# EAGLE design attinier85-motherboard-smd-mk-2.0 (EAGLE 7.5.0)
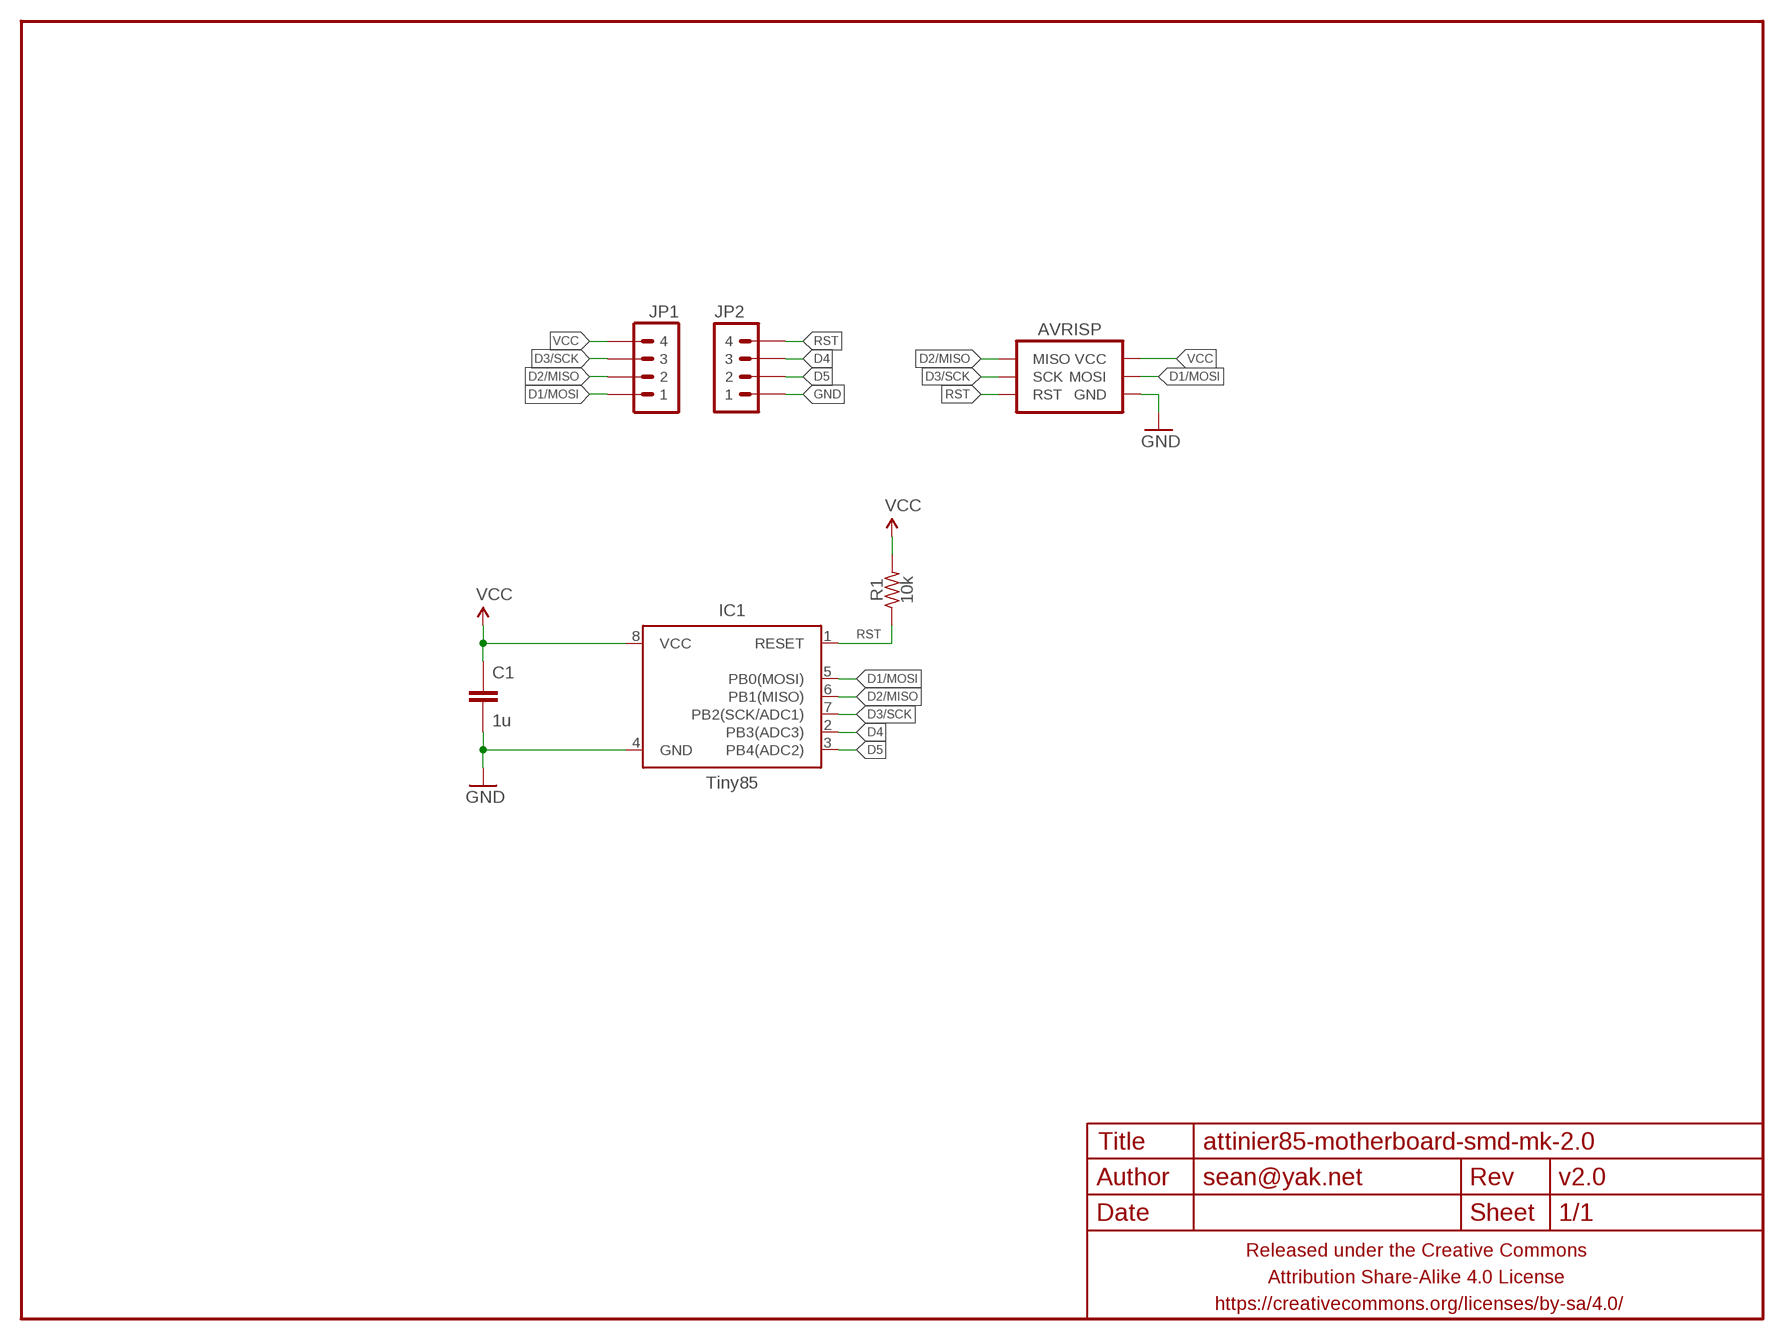
[diagram p0: schematic, sheet 1]

## Parts
AVRISP  AVR_SPI_PRG_6SMD_TEST_POINTS  [2X3_SMD_TEST_POINTS]
C1  1u  CAPACITOR-CERAMICC0603-TIGHTER  [C0603-TIGHTER]
FRAME1  FRAME-LETTERNO_PACKAGE  [DUMMY]
IC1  Tiny85  ATTINY45TINY85-20-SOICW  [SO08-EIAJ]
JP1  M04PTH  [1X04-PTH-VERT]
JP2  M04PTH  [1X04-PTH-VERT]
R1  10k  RESISTORR0603-TIGHTER  [R0603-TIGHTER]

## Nets
D1/MOSI: AVRISP.4(MOSI) IC1.5(PB0(MOSI)) JP1.1
D2/MISO: AVRISP.1(MISO) IC1.6(PB1(MISO)) JP1.2
D3/SCK: AVRISP.3(SCK) IC1.7(PB2(SCK/ADC1)) JP1.3
D4: IC1.2(PB3(ADC3)) JP2.3
D5: IC1.3(PB4(ADC2)) JP2.2
GND: AVRISP.6(GND) C1.2 IC1.4(GND) JP2.1
RST: AVRISP.5(RST) IC1.1(RESET) JP2.4 R1.1
VCC: AVRISP.2(VCC) C1.1 IC1.8(VCC) JP1.4 R1.2

## Library data of the parts
AVRISP = a_parts:AVR_SPI_PRG_6: AVR ISP 6 Pin This is the reduced ISP connector for AVR programming. Common on Arduino. This footprint will take up less PCB space and can be used with a 10-pin to 6-pin adapter such as SKU: BOB-08508 **Special note about "TEST_POINT" package. The stop mask is on the top side, so if you want your programming test points to be on the bottom of your board, make sure to place this package on the bottom side of the board. This also ensure that the orientation to program from the bottom side will be correct.
C1 = a_parts:CAPACITOR-CERAMIC: CAPACITOR, European symbol
FRAME1 = a_parts:FRAME-LETTER: Schematic Frame Standard 8.5x11 US Letter frame; DESIGNER: sean@yak.net; VERSION: v2.0
IC1 = a_parts:ATTINY45: Atmel 8-pin 2/4/8kB flash uC; PROD_ID: IC-09092; VALUE: Tiny85-20-SMT
JP1 JP2 = a_parts:M04: Header 4 Standard 4-pin 0.1" header. Use with straight break away headers (SKU : PRT-00116), right angle break away headers (PRT-00553), swiss pins (PRT-00743), machine pins (PRT-00117), and female headers (PRT-00115). Molex polarized connector foot print use with SKU : PRT-08231 with associated crimp pins and housings. 1MM SMD Version SKU: PRT-10208
R1 = a_parts:RESISTOR: RESISTOR, American symbol

## Board
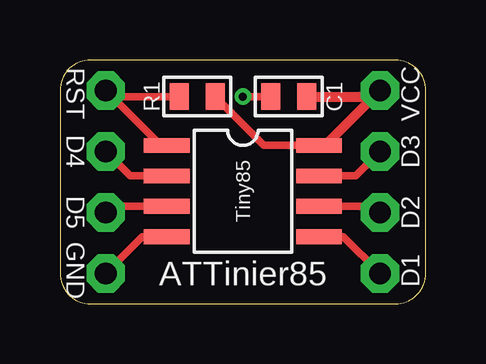
[diagram p1: board, top side]
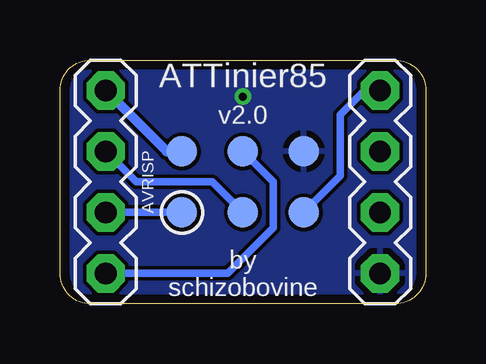
[diagram p2: board, bottom side, seen from below]

Size 15.24 x 10.16 mm. Coordinates in mm from the lower left corner, seen from the top.
Outline: 15.24,1.27 15.24,8.89 arc90 13.97,10.16 1.27,10.16 arc90 0,8.89 0,1.27 arc90 1.27,0 13.97,0 arc90 15.24,1.27
Copper layers (1*16): Top 0.0356mm / dielectric 1.5011mm / Bottom 0.0356mm
Design rules "LaenPCBOrder2": minimum track width 6mil, minimum drill 13mil, track to track 6mil, track to pad 6mil, pad to pad 6mil, via to via 6mil, smd to smd 6mil, copper to edge 15mil, drill to drill 6mil, minimum pad ring 7mil, minimum via ring 7mil, stop-mask expansion 3mil, vias tented up to drill 20mil, thermal gap 10mil

### Footprints (pad centres in the part's own frame; a part is rotated, then mirrored left to right if it is on the bottom)
2X3_SMD_TEST_POINTS = smd 1.27 x 1.27: 1 -2.54,-1.27; 2 -2.54,1.27; 3 0,-1.27; 4 0,1.27; 5 2.54,-1.27; 6 2.54,1.27
C0603-TIGHTER = smd 0.8 x 1.1: 1 -0.75,0; 2 0.75,0
SO08-EIAJ = smd 0.61 x 1.905: 1 -1.905,-3.175; 2 -0.635,-3.175; 3 0.635,-3.175; 4 1.905,-3.175; 5 1.905,3.175; 6 0.635,3.175; 7 -0.635,3.175; 8 -1.905,3.175
1X04-PTH-VERT = drill 0.9 pad 1.6 octagon: 1 0,0; 2 2.54,0; 3 5.08,0; 4 7.62,0
R0603-TIGHTER = smd 0.8 x 1.1: 1 -0.75,0; 2 0.75,0

### Placement (x,y rotation side)
AVRISP  7.62,5.08 0 bottom
C1  9.53,8.64 180 top
FRAME1  0,0 0 top
IC1  7.62,4.7 270 top
JP1  13.34,1.27 90 bottom
JP2  1.91,1.27 90 bottom
R1  5.71,8.64 0 top

### Tracks (layer width: path | path; a pad name or v marks a point on that pad's centre or on a via)
D1/MOSI
  Top 0.305: IC1.5 11.81,2.79 JP1.1
  Bottom 0.305: AVRISP.4 6.35,5.08 6.35,3.17 8.26,1.27 JP1.1
D2/MISO
  Top 0.305: IC1.6 13.08,4.06 JP1.2
  Bottom 0.305: AVRISP.1 JP1.2
D3/SCK
  Top 0.305: IC1.7 12.32,5.33 JP1.3
  Bottom 0.305: AVRISP.3 8.89,5.08 12.06,5.08 JP1.3
D4
  Top 0.305: IC1.2 2.92,5.33 JP2.3
D5
  Top 0.305: IC1.3 2.16,4.06 JP2.2
GND  (via drill 0.33)
  Top 0.305: JP2.1 3.43,2.79 IC1.4 | v7.62,8.64 C1.2
  pour Bottom: 1.27,10.16 13.97,10.16 arc-90 15.24,8.89 15.24,1.27 arc-90 13.97,0 1.27,0 arc-90 0,1.27 0,8.89 arc-90
RST
  Top 0.305: R1.1 2.16,8.64 JP2.4 4.19,6.6 IC1.1
  Bottom 0.305: AVRISP.5 3.56,5.33 3.56,7.87 2.54,8.89 JP2.4
VCC
  Top 0.305: R1.2 8.5,6.6 IC1.8
  Top 0.406: IC1.8 11.05,6.6 JP1.4 13.08,8.64 C1.1
  Bottom 0.406: AVRISP.2 10.79,6.35 JP1.4

### Text on the board
tPlace: ATTinier85
bPlace: ATTinier85 | by / schizobovine
tNames: RST | VCC | D4 | D3 | D5 | D2 | GND | D1